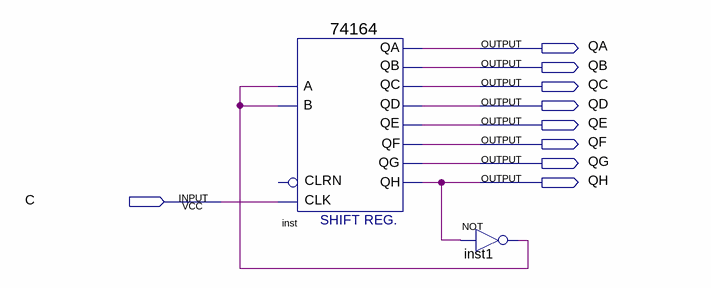
[diagram p0: schematic sheet]
// Quartus schematic v3z2.bdf as structural Verilog: 2 symbols, 9 pins
module v3z2 (
  input  C,
  output QA,
  output QB,
  output QC,
  output QD,
  output QE,
  output QF,
  output QG,
  output QH
);

  wire inst1_out;

  \74164  inst (
    .CLK(C), .B(inst1_out), .A(inst1_out), .QD(QD), .QC(QC), .QA(QA), .QF(QF), .QH(QH), .QG(QG), .QE(QE),
    .QB(QB));  // open: CLRN
  not inst1 (inst1_out, QH);
endmodule
